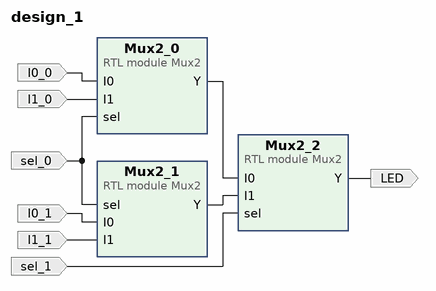
[diagram p0: block diagram of the top level]
# Vivado block design design_1, xc7a100tcsg324-1, Vivado 2023.2
create_bd_design design_1

create_bd_port -dir I I0_0
create_bd_port -dir I I1_0
create_bd_port -dir I sel_0
create_bd_port -dir I I0_1
create_bd_port -dir I I1_1
create_bd_port -dir O LED
create_bd_port -dir I sel_1

create_bd_cell -type module -reference Mux2 Mux2_0
create_bd_cell -type module -reference Mux2 Mux2_1
create_bd_cell -type module -reference Mux2 Mux2_2

# ---- connections ----

connect_bd_net -net I0_0_1 [get_bd_ports I0_0] [get_bd_pins Mux2_0/I0]
connect_bd_net -net I0_1_1 [get_bd_ports I0_1] [get_bd_pins Mux2_1/I0]
connect_bd_net -net I1_0_1 [get_bd_ports I1_0] [get_bd_pins Mux2_0/I1]
connect_bd_net -net I1_1_1 [get_bd_ports I1_1] [get_bd_pins Mux2_1/I1]
connect_bd_net [get_bd_pins Mux2_0/Y] [get_bd_pins Mux2_2/I0]
connect_bd_net [get_bd_pins Mux2_1/Y] [get_bd_pins Mux2_2/I1]
connect_bd_net [get_bd_pins Mux2_2/Y] [get_bd_ports LED]
connect_bd_net -net sel_0_1 [get_bd_ports sel_0] [get_bd_pins Mux2_0/sel] [get_bd_pins Mux2_1/sel]
connect_bd_net -net sel_1_1 [get_bd_ports sel_1] [get_bd_pins Mux2_2/sel]

validate_bd_design
save_bd_design
